# EAGLE design CharlieReactorBreakout (EAGLE 6.5.0)
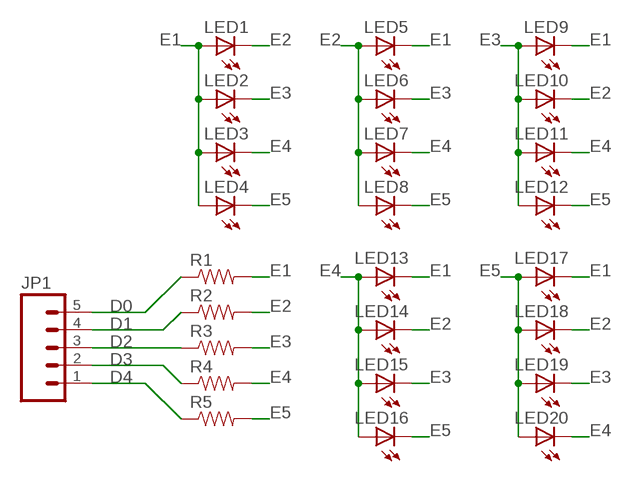
[diagram p0: schematic, sheet 1]

## Parts
JP1  M05PTH  [1X05]
LED1  LEDOVAL  [LED-OVAL]
LED2  LEDOVAL  [LED-OVAL]
LED3  LEDOVAL  [LED-OVAL]
LED4  LEDOVAL  [LED-OVAL]
LED5  LEDOVAL  [LED-OVAL]
LED6  LEDOVAL  [LED-OVAL]
LED7  LEDOVAL  [LED-OVAL]
LED8  LEDOVAL  [LED-OVAL]
LED9  LEDOVAL  [LED-OVAL]
LED10  LEDOVAL  [LED-OVAL]
LED11  LEDOVAL  [LED-OVAL]
LED12  LEDOVAL  [LED-OVAL]
LED13  LEDOVAL  [LED-OVAL]
LED14  LEDOVAL  [LED-OVAL]
LED15  LEDOVAL  [LED-OVAL]
LED16  LEDOVAL  [LED-OVAL]
LED17  LEDOVAL  [LED-OVAL]
LED18  LEDOVAL  [LED-OVAL]
LED19  LEDOVAL  [LED-OVAL]
LED20  LEDOVAL  [LED-OVAL]
R1  RESISTORAXIAL-0.3  [AXIAL-0.3]
R2  RESISTORAXIAL-0.3  [AXIAL-0.3]
R3  RESISTORAXIAL-0.3  [AXIAL-0.3]
R4  RESISTORAXIAL-0.3  [AXIAL-0.3]
R5  RESISTORAXIAL-0.3  [AXIAL-0.3]

## Nets
D0: JP1.5 R1.P$1
D1: JP1.4 R2.P$1
D2: JP1.3 R3.P$1
D3: JP1.2 R4.P$1
D4: JP1.1 R5.P$1
E1: LED1.ANODE(A) LED2.ANODE(A) LED3.ANODE(A) LED4.ANODE(A) LED5.CATHODE(C) LED9.CATHODE(C) LED13.CATHODE(C) LED17.CATHODE(C) R1.P$2
E2: LED1.CATHODE(C) LED5.ANODE(A) LED6.ANODE(A) LED7.ANODE(A) LED8.ANODE(A) LED10.CATHODE(C) LED14.CATHODE(C) LED18.CATHODE(C) R2.P$2
E3: LED2.CATHODE(C) LED6.CATHODE(C) LED9.ANODE(A) LED10.ANODE(A) LED11.ANODE(A) LED12.ANODE(A) LED15.CATHODE(C) LED19.CATHODE(C) R3.P$2
E4: LED3.CATHODE(C) LED7.CATHODE(C) LED11.CATHODE(C) LED13.ANODE(A) LED14.ANODE(A) LED15.ANODE(A) LED16.ANODE(A) LED20.CATHODE(C) R4.P$2
E5: LED4.CATHODE(C) LED8.CATHODE(C) LED12.CATHODE(C) LED16.CATHODE(C) LED17.ANODE(A) LED18.ANODE(A) LED19.ANODE(A) LED20.ANODE(A) R5.P$2

## Library data of the parts
JP1 = SparkFun-Connectors:M05: Header 5 Standard 5-pin 0.1" header. Use with straight break away headers (SKU : PRT-00116), right angle break away headers (PRT-00553), swiss pins (PRT-00743), machine pins (PRT-00117), and female headers (PRT-00115). Molex polarized connector foot print use with SKU : PRT-08230 with associated crimp pins and housings.
LED1-LED20 = barbary_enterprises:LED: LEDs Standard schematic elements and footprints for 5mm, 3mm, 1206, and 0603 sized LEDs. 5mm - Spark Fun Electronics SKU : COM-00529 (and others)
R1-R5 = barbary_enterprises:RESISTOR: Resistor Basic schematic elements and footprints for 0603, 1206, and PTH resistors.

## Board
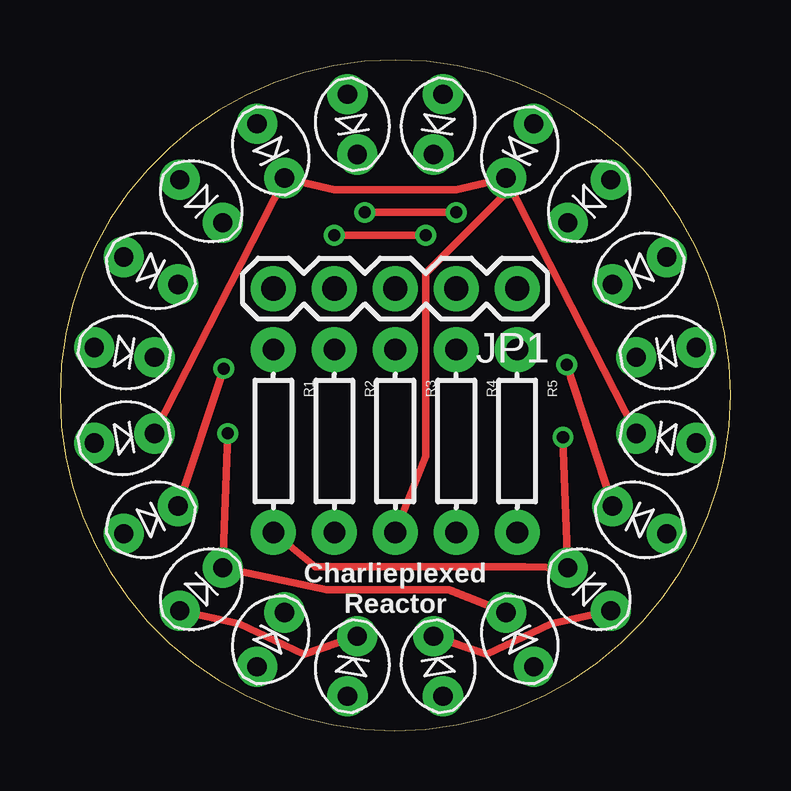
[diagram p1: board, top side]
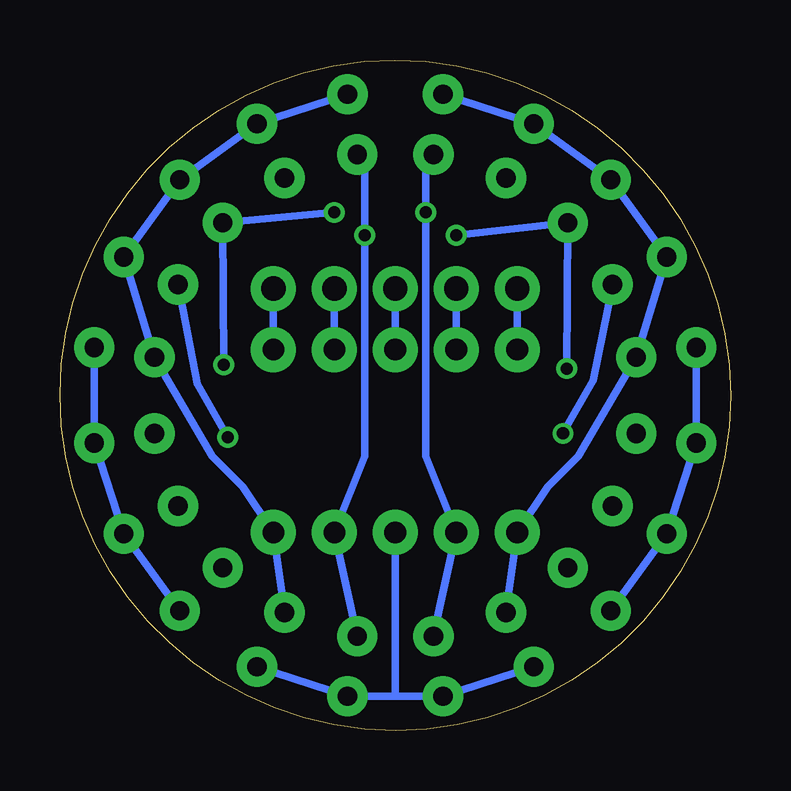
[diagram p2: board, bottom side, seen from below]

Size 27.94 x 27.94 mm. Coordinates in mm from the lower left corner, seen from the top.
Outline: 0,13.96 arc90 13.96,0 arc90 27.94,13.98 arc90 13.98,27.94 arc90 0,13.96
Copper layers (1*16): Top 0.0356mm / dielectric 1.5011mm / Bottom 0.0356mm
Design rules "LaenPCBOrder": minimum track width 6mil, minimum drill 13mil, track to track 6mil, track to pad 6mil, pad to pad 6mil, via to via 6mil, smd to smd 6mil, copper to edge 15mil, drill to drill 6mil, minimum pad ring 7mil, minimum via ring 7mil, stop-mask expansion 3mil, vias tented up to drill 0mil, thermal gap 10mil

### Footprints (pad centres in the part's own frame; a part is rotated, then mirrored left to right if it is on the bottom)
1X05 = drill 1.016 pad 1.88: 1 0,0; 2 2.54,0; 3 5.08,0; 4 7.62,0; 5 10.16,0
LED-OVAL = drill 0.8 pad 1.676: ANODE 1.27,0; CATHODE -1.27,0
AXIAL-0.3 = drill 0.9 pad 1.88: P$1 -3.81,0; P$2 3.81,0

### Placement (x,y rotation side)
JP1  19.05,18.41 180 top
LED1  12.18,25.26 99 top
LED2  8.78,24.15 117 top
LED3  5.89,22.05 135 top
LED4  3.79,19.16 153 top
LED5  2.68,15.76 171 top
LED6  2.68,12.18 189 top
LED7  3.79,8.78 207 top
LED8  5.89,5.89 225 top
LED9  8.78,3.79 243 top
LED10  12.18,2.68 261 top
LED11  15.76,2.68 279 top
LED12  19.16,3.79 297 top
LED13  22.05,5.89 315 top
LED14  24.15,8.78 333 top
LED15  25.26,12.18 351 top
LED16  25.26,15.76 9 top
LED17  24.15,19.16 27 top
LED18  22.05,22.05 45 top
LED19  19.16,24.15 63 top
LED20  15.76,25.26 81 top
R1  8.89,12.06 270 top
R2  11.43,12.06 270 top
R3  13.97,12.06 270 top
R4  16.51,12.06 270 top
R5  19.05,12.06 270 top

### Tracks (layer width: path | path; a pad name or v marks a point on that pad's centre or on a via)
D0
  Bottom 0.305: R1.P$1 JP1.5
D1
  Bottom 0.305: R2.P$1 JP1.4
D2
  Bottom 0.305: R3.P$1 JP1.3
D3
  Bottom 0.305: R4.P$1 JP1.2
D4
  Bottom 0.305: R5.P$1 JP1.1
E1  (via drill 0.51)
  Top 0.305: v20.95,12.22 LED13.CATHODE 19.37,6.83 10.64,6.83 R1.P$2
  Bottom 0.305: LED9.CATHODE R1.P$2 7.62,10.16 6.35,11.43 LED5.CATHODE LED4.ANODE LED3.ANODE LED2.ANODE LED1.ANODE | LED17.CATHODE 22.23,14.45 v20.95,12.22
E2  (via drill 0.51)
  Top 0.305: v16.51,21.59 v12.7,21.59 | LED14.CATHODE v21.11,15.24 | LED8.ANODE 7.46,4.45 10.16,3.17 LED10.CATHODE
  Bottom 0.305: LED10.CATHODE R2.P$2 12.7,11.43 v12.7,21.59 12.7,23.69 LED1.CATHODE | LED8.ANODE LED7.ANODE LED6.ANODE LED5.ANODE | v16.51,21.59 LED18.CATHODE v21.11,15.24
E3
  Top 0.305: LED6.CATHODE LED2.CATHODE 11.43,22.54 16.51,22.54 LED19.CATHODE | LED19.CATHODE LED15.CATHODE | R3.P$2 15.24,11.43 15.24,19.05 18.58,22.39 LED19.CATHODE
  Bottom 0.305: 13.97,1.43 LED11.ANODE LED12.ANODE | 13.97,1.43 LED10.ANODE LED9.ANODE | R3.P$2 13.97,1.43
E4  (via drill 0.51)
  Top 0.305: v11.43,20.64 v15.24,20.64 | LED7.CATHODE v6.83,15.08 | LED13.ANODE 20.48,4.45 17.78,3.17 LED11.CATHODE
  Bottom 0.305: LED11.CATHODE R4.P$2 15.24,11.43 v15.24,20.64 15.24,23.69 LED20.CATHODE | LED13.ANODE LED14.ANODE LED15.ANODE LED16.ANODE | v11.43,20.64 LED3.CATHODE v6.83,15.08
E5  (via drill 0.51)
  Top 0.305: v6.99,12.38 LED8.CATHODE 11.11,5.87 16.19,5.87 LED12.CATHODE
  Bottom 0.305: LED12.CATHODE R5.P$2 20.32,10.16 21.59,11.43 LED16.CATHODE LED17.ANODE LED18.ANODE LED19.ANODE LED20.ANODE | v6.99,12.38 5.71,14.61 LED4.CATHODE

### Text on the board
tPlace: Charlieplexed | Reactor